# EAGLE design vca (EAGLE 7.2.0)
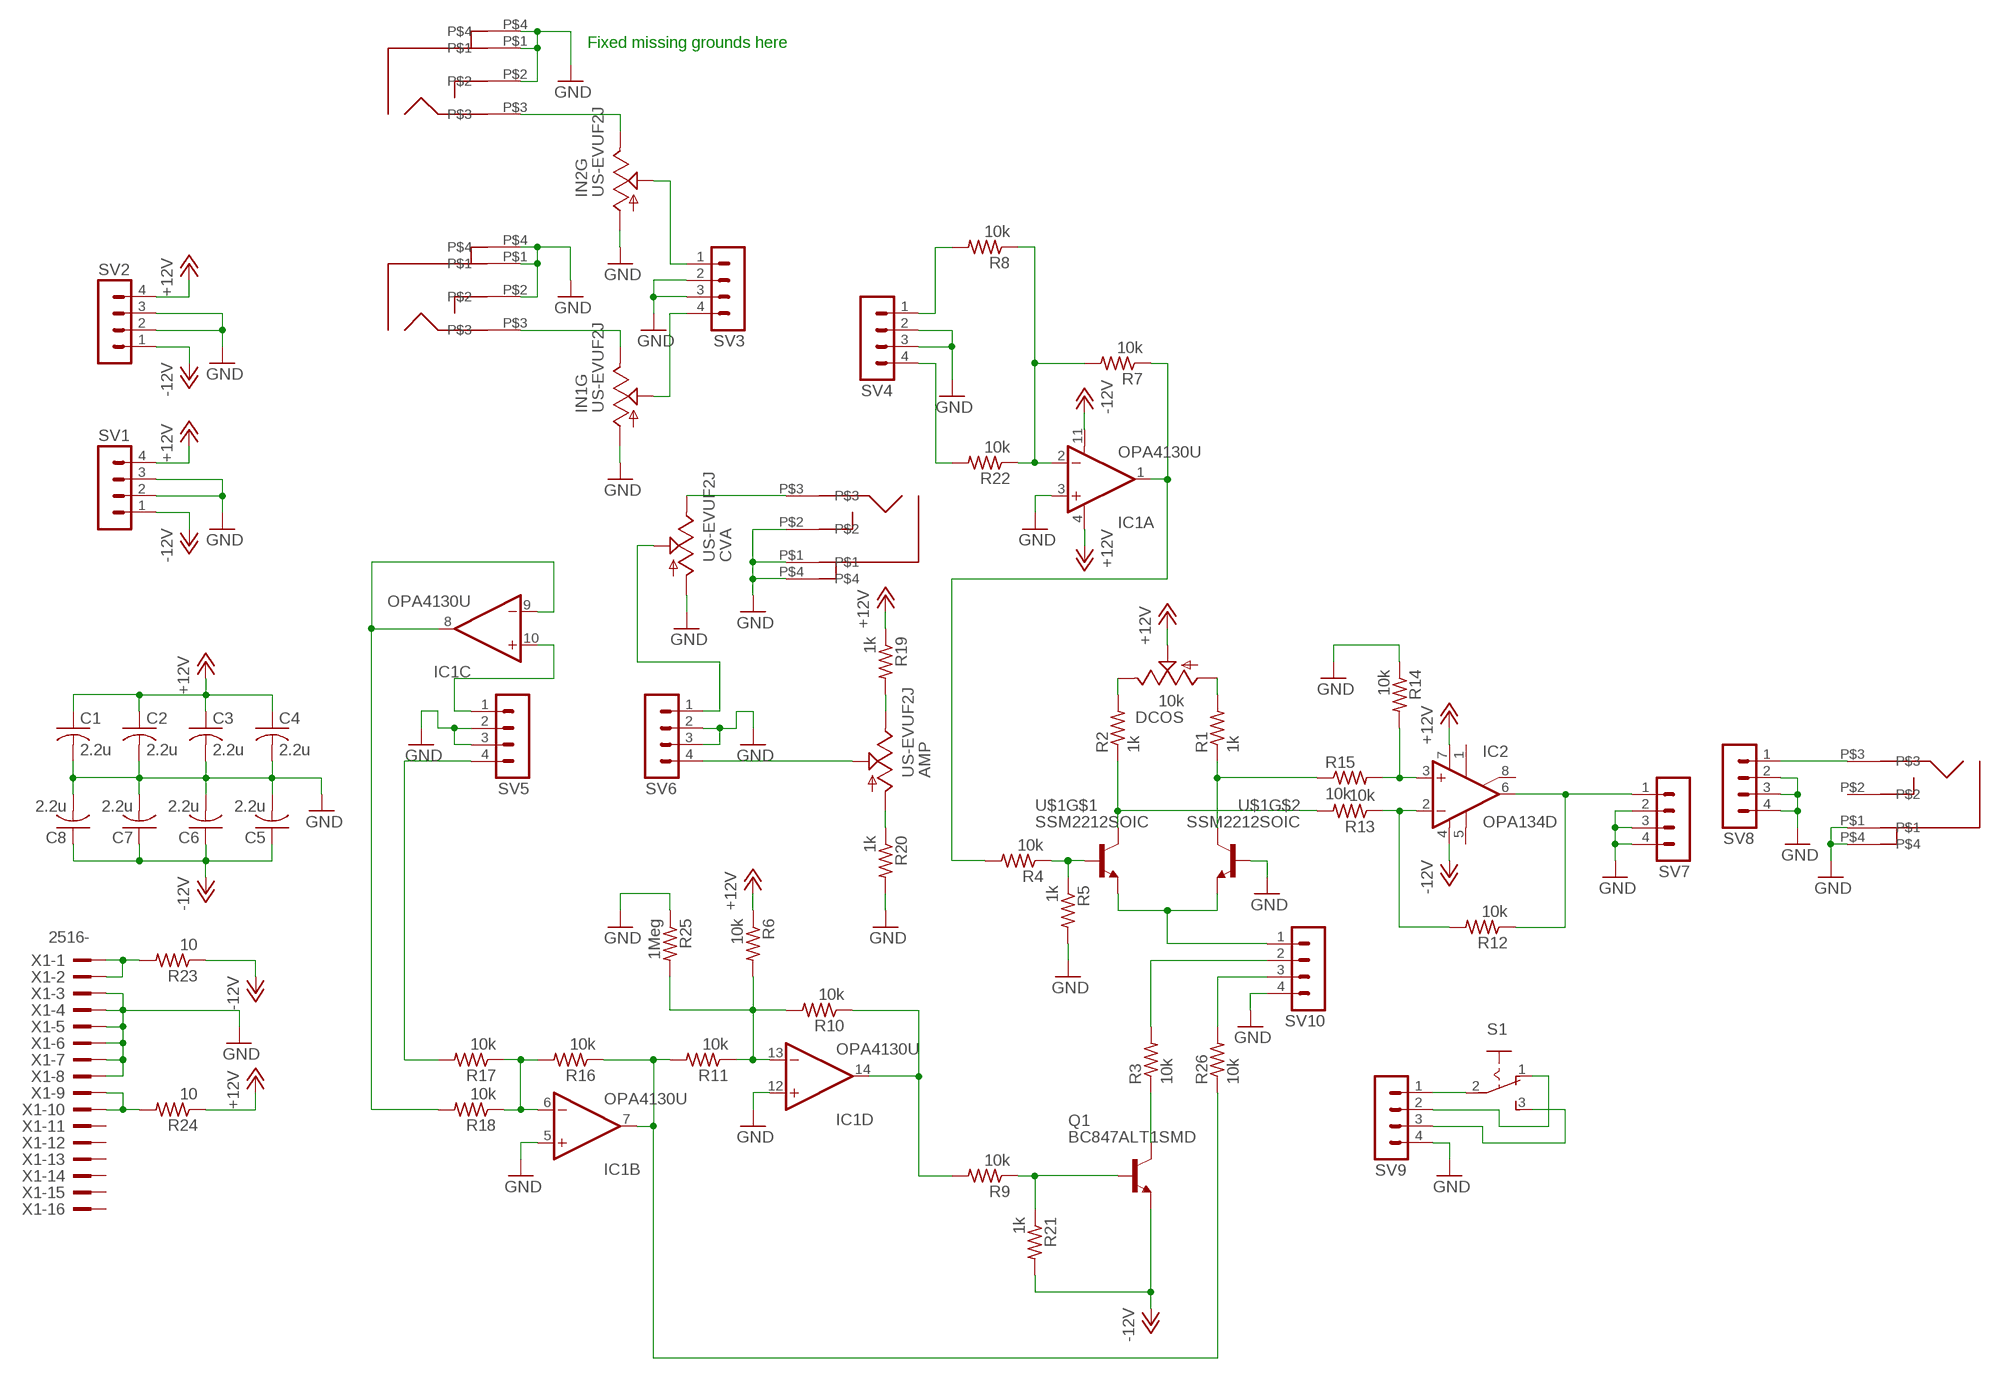
[diagram p0: schematic, sheet 1]

## Parts
AMP  US-EVUF2J  [EVUFXJ]
C1  2.2u  C-USC0603  [C0603]
C2  2.2u  C-USC0603  [C0603]
C3  2.2u  C-USC0603  [C0603]
C4  2.2u  C-USC0603  [C0603]
C5  2.2u  C-USC0603  [C0603]
C6  2.2u  C-USC0603  [C0603]
C7  2.2u  C-USC0603  [C0603]
C8  2.2u  C-USC0603  [C0603]
CVA  US-EVUF2J  [EVUFXJ]
CVIN  PJ301BM  [PJ301BM]
DCOS  10k  TRIM_US-RJ9W  [RJ9W]
IC1  OPA4130U  [SO14]
IC2  OPA134D  [SO08]
IN1  PJ301BM  [PJ301BM]
IN1G  US-EVUF2J  [EVUFXJ]
IN2  PJ301BM  [PJ301BM]
IN2G  US-EVUF2J  [EVUFXJ]
OUT  PJ301BM  [PJ301BM]
Q1  BC847ALT1SMD  [SOT23]
R1  1k  R-US_R0603  [R0603]
R2  1k  R-US_R0603  [R0603]
R3  10k  R-US_R0603  [R0603]
R4  10k  R-US_R0603  [R0603]
R5  1k  R-US_R0603  [R0603]
R6  10k  R-US_R0603  [R0603]
R7  10k  R-US_R0603  [R0603]
R8  10k  R-US_R0603  [R0603]
R9  10k  R-US_R0603  [R0603]
R10  10k  R-US_R0603  [R0603]
R11  10k  R-US_R0603  [R0603]
R12  10k  R-US_R0603  [R0603]
R13  10k  R-US_R0603  [R0603]
R14  10k  R-US_R0603  [R0603]
R15  10k  R-US_R0603  [R0603]
R16  10k  R-US_R0603  [R0603]
R17  10k  R-US_R0603  [R0603]
R18  10k  R-US_R0603  [R0603]
R19  1k  R-US_R0603  [R0603]
R20  1k  R-US_R0603  [R0603]
R21  1k  R-US_R0603  [R0603]
R22  10k  R-US_R0603  [R0603]
R23  10  R-US_R0603  [R0603]
R24  10  R-US_R0603  [R0603]
R25  1Meg  R-US_R0603  [R0603]
R26  10k  R-US_R0603  [R0603]
S1  255SB  [255SB]
SV1  MA04-1  [MA04-1]
SV2  MA04-1  [MA04-1]
SV3  MA04-1  [MA04-1]
SV4  MA04-1  [MA04-1]
SV5  MA04-1  [MA04-1]
SV6  MA04-1  [MA04-1]
SV7  MA04-1  [MA04-1]
SV8  MA04-1  [MA04-1]
SV9  MA04-1  [MA04-1]
SV10  MA04-1  [MA04-1]
U$1  SSM2212SOIC  [SO08]
X1  2516-  [PAK100/2500-16]

## Nets
+12V: C1.1 C2.1 C3.1 C4.1 DCOS.S IC1.4(A:V+) IC2.7(V+) R6.1 R19.1 R24.1 SV1.4 SV2.4
-12V: C5.1 C6.1 C7.1 C8.1 IC1.11(A:V-) IC2.4(V-) Q1.2(E) R21.2 R23.1 SV1.1 SV2.1
GND: C1.2 C2.2 C3.2 C4.2 C5.2 C6.2 C7.2 C8.2 CVA.1(A) CVIN.P$1 CVIN.P$2 CVIN.P$4 IC1.3(A:+IN) IC1.5(B:+IN) IC1.12(D:+IN) IN1.P$1 IN1.P$2 IN1.P$4 IN1G.1(A) IN2.P$1 IN2.P$2 IN2.P$4 IN2G.1(A) OUT.P$1 OUT.P$4 R5.2 R14.1 R20.2 R25.1 SV1.2 SV1.3 SV2.2 SV2.3 SV3.2 SV3.3 SV4.2 SV4.3 SV5.2 SV5.3 SV6.2 SV6.3 SV7.2 SV7.3 SV7.4 SV8.2 SV8.3 SV8.4 SV9.4 SV10.4 U$1.7(B) X1.3 X1.4 X1.5 X1.6 X1.7 X1.8
N$1: SV10.1 U$1.3(E) U$1.6(E)
N$2: R4.1 R5.1 U$1.2(B)
N$3: R2.1 R13.2 U$1.1(C)
N$4: R1.1 R15.1 U$1.8(C)
N$5: OUT.P$3 SV8.1
N$6: IC1.8(C:OUT) IC1.9(C:-IN) R18.2
N$7: Q1.3(C) R3.1
N$8: Q1.1(B) R9.1 R21.1
N$9: IC1.14(D:OUT) R9.2 R10.1
N$10: IC1.2(A:-IN) R7.2 R8.1 R22.1
N$11: IC1.1(A:OUT) R4.2 R7.1
N$12: IC1.13(D:-IN) R6.2 R10.2 R11.1 R25.2
N$13: IC2.3(+IN) R14.2 R15.2
N$14: DCOS.E R2.2
N$15: DCOS.A R1.2
N$16: IC2.2(-IN) R12.2 R13.1
N$18: IC2.6(OUT) R12.1 SV7.1
N$19: IN2G.2(S) SV3.1
N$20: IC1.6(B:-IN) R16.2 R17.1 R18.1
N$21: IN1G.2(S) SV3.4
N$22: AMP.3(E) R19.2
N$23: AMP.1(A) R20.1
N$24: R17.2 SV5.4
N$25: IN1.P$3 IN1G.3(E)
N$26: CVA.3(E) CVIN.P$3
N$27: IN2.P$3 IN2G.3(E)
N$28: R8.2 SV4.1
N$29: R22.2 SV4.4
N$30: R23.2 X1.1 X1.2
N$31: CVA.2(S) SV6.1
N$32: AMP.2(S) SV6.4
N$33: IC1.10(C:+IN) SV5.1
N$34: R24.2 X1.9 X1.10
N$35: R3.2 SV10.2
N$36: IC1.7(B:OUT) R11.2 R16.1 R26.1
N$37: S1.2(P) SV9.1
N$38: R26.2 SV10.3
N$40: S1.1(O) SV9.2
N$41: S1.3(S) SV9.3
Unconnected: IC2.1(ON1) IC2.5(OPT) IC2.8(ON2) OUT.P$2 X1.11 X1.12 X1.13 X1.14 X1.15 X1.16

## Notes on the sheet
- Fixed missing grounds here

## Library data of the parts
AMP CVA IN1G IN2G = dan:US-EVU: 9 mm Square Rotary Potentiometers Source: Panasonic
C1-C8 = dan:C-US: CAPACITOR, American symbol
CVIN IN1 IN2 OUT = dan:PJ301BM
DCOS = dan:TRIM_US-: POTENTIOMETER
IC1 = dan:OPA4130: Low Power, Precision FET-Input Operational Amplifiers; MF: TEXAS INSTRUMENTS; MPN: OPA4130UA; OC_FARNELL: 1648707; OC_NEWARK: 80K8080
IC2 = dan:OPA134: AUDIO AMPLIFIER
Q1 = dan:BC847*: NPN Transistor
R1-R26 = dan:R-US_: RESISTOR, American symbol
S1 = dan:255SB: SLIDING SWITCH Distributor Buerklin, 11G810
SV1-SV10 = dan:MA04-1: PIN HEADER; OC_FARNELL: unknown; OC_NEWARK: unknown
U$1 = dan:SSM2212
X1 = dan:2516-: 3M (TM) Pak 100 4-Wall Header Source: 3M; OC_FARNELL: unknown; OC_NEWARK: unknown

## Board
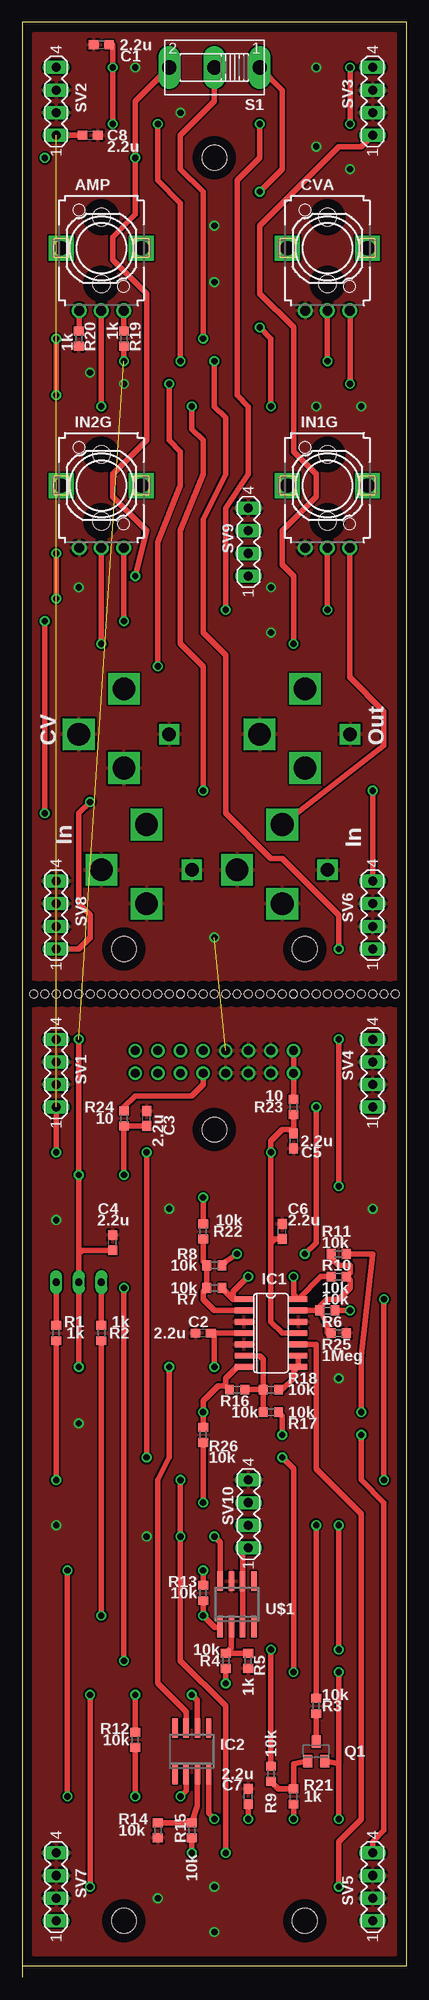
[diagram p1: board, top side]
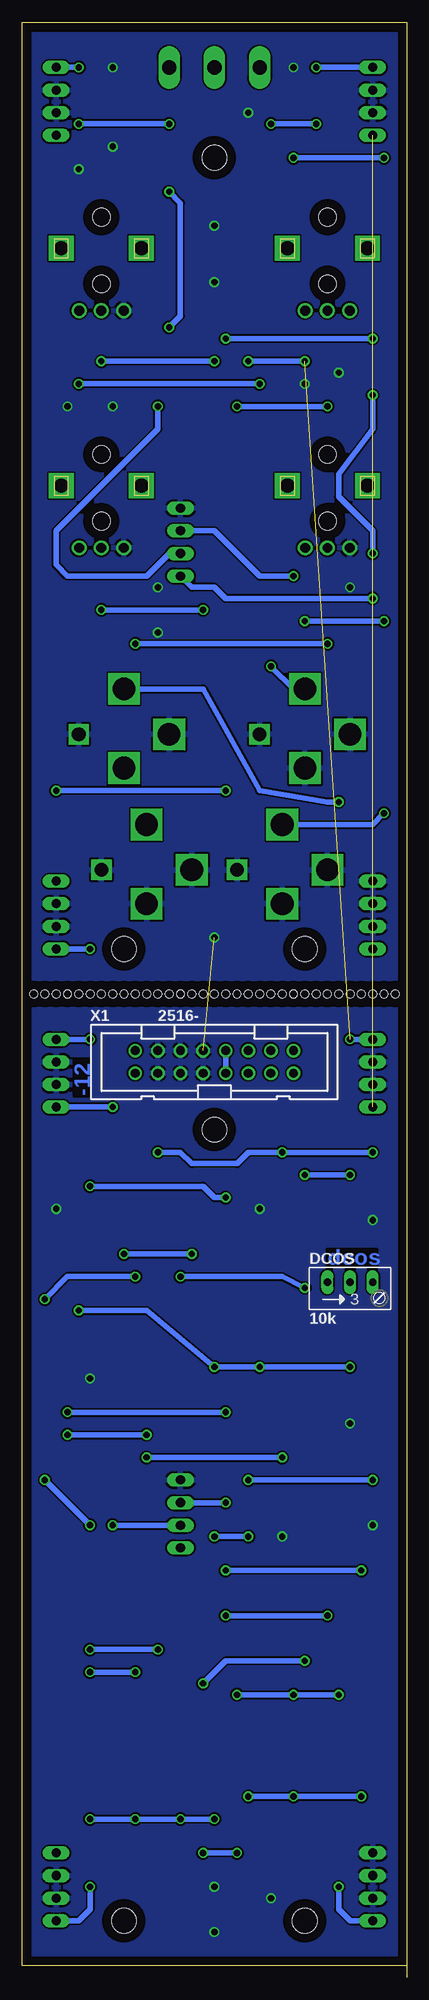
[diagram p2: board, bottom side, seen from below]

Size 43.18 x 219.71 mm. Coordinates in mm from the lower left corner, seen from the top.
Outline: 0,1.27 43.18,1.27 43.18,219.71 0,219.71 0,1.27
Outline: 0,1.27 0,0
Copper layers (1*16): Top 0.035mm / dielectric 1.5mm / Bottom 0.035mm
Design rules "default": minimum track width 10mil, minimum drill 24mil, track to track 8mil, track to pad 8mil, pad to pad 8mil, via to via 8mil, smd to smd 8mil, copper to edge 40mil, drill to drill 8mil, minimum pad ring 10mil, minimum via ring 8mil, stop-mask expansion 4mil, vias tented up to drill 0mil, thermal gap 10mil
Holes 0.9 mm at 1.27,110.49 2.54,110.49 3.81,110.49 5.08,110.49 6.35,110.49 7.62,110.49 8.89,110.49 10.16,110.49 11.43,110.49 12.7,110.49 13.97,110.49 15.24,110.49 16.51,110.49 17.78,110.49 19.05,110.49 20.32,110.49 21.59,110.49 22.86,110.49 24.13,110.49 25.4,110.49 26.67,110.49 27.94,110.49 29.21,110.49 30.48,110.49 31.75,110.49 33.02,110.49 34.29,110.49 35.56,110.49 36.83,110.49 38.1,110.49 39.37,110.49 40.64,110.49 41.91,110.49
Holes 2.8 mm at 11.43,6.35 31.75,6.35 31.75,115.57 11.43,115.57 21.59,95.25 21.59,204.47

### Footprints (pad centres in the part's own frame; a part is rotated, then mirrored left to right if it is on the bottom)
EVUFXJ = drill 1.1 pad 1.676: 1 -2.5,-7; 2 0,-7; 3 2.5,-7 | drill 1.6 pad 2.8 square: M1 4.5,0; M2 -4.5,0 | hole 2: 0,3.5; 0,-4
C0603 = smd 1.1 x 1: 1 -0.85,0; 2 0.85,0
PJ301BM = drill 1.524 square: P$1 5.08,0 | drill 2.54 square: P$2 0,-3.81; P$3 0,5.08; P$4 -5.08,0
RJ9W = drill 0.813 long: A 2.54,0.635; E -2.54,0.635; S 0,0.635
SO14 = smd 0.66 x 2.032: 1 -3.81,-3.073; 2 -2.54,-3.073; 3 -1.27,-3.073; 4 0,-3.073; 5 1.27,-3.073; 6 2.54,-3.073; 7 3.81,-3.073; 8 3.81,3.073; 9 2.54,3.073; 10 1.27,3.073; 11 0,3.073; 12 -1.27,3.073; 13 -2.54,3.073; 14 -3.81,3.073
SO08 = smd 0.6 x 2.2: 1 -1.905,-2.6; 2 -0.635,-2.6; 3 0.635,-2.6; 4 1.905,-2.6; 5 1.905,2.6; 6 0.635,2.6; 7 -0.635,2.6; 8 -1.905,2.6
SOT23 = smd 1 x 1.4: 1 -0.95,-1.1; 2 0.95,-1.1; 3 0,1.1
R0603 = smd 1 x 1.1: 1 -0.85,0; 2 0.85,0
255SB = drill 1.6 long: 1 -5.08,0; 2 0,0; 3 5.08,0
MA04-1 = drill 1.016 long: 1 -3.81,0; 2 -1.27,0; 3 1.27,0; 4 3.81,0
PAK100/2500-16 = drill 1 pad 1.422: 1 -8.89,-1.27; 2 -8.89,1.27; 3 -6.35,-1.27; 4 -6.35,1.27; 5 -3.81,-1.27; 6 -3.81,1.27; 7 -1.27,-1.27; 8 -1.27,1.27; 9 1.27,-1.27; 10 1.27,1.27; 11 3.81,-1.27; 12 3.81,1.27; 13 6.35,-1.27; 14 6.35,1.27; 15 8.89,-1.27; 16 8.89,1.27

### Placement (x,y rotation side)
AMP  8.89,194.31 0 top
C1  8.89,217.17 180 top
C2  20.32,72.39 180 top
C3  13.97,96.52 90 top
C4  10.16,82.55 90 top
C5  30.48,93.98 270 top
C6  29.21,83.82 90 top
C7  25.4,20.32 90 top
C8  7.62,207.01 0 top
CVA  34.29,194.31 0 top
CVIN  11.43,139.7 0 top
DCOS  6.35,77.47 0 bottom
IC1  27.94,72.39 270 top
IC2  19.05,25.4 0 top
IN1  29.21,124.46 0 top
IN1G  34.29,167.64 0 top
IN2  13.97,124.46 0 top
IN2G  8.89,167.64 0 top
OUT  31.75,139.7 0 top
Q1  33.02,25.4 0 top
R1  3.81,72.39 90 top
R2  8.89,72.39 90 top
R3  33.02,30.48 90 top
R4  22.86,35.56 270 top
R5  25.4,35.56 270 top
R6  34.29,74.93 180 top
R7  21.59,77.47 180 top
R8  21.59,80.01 0 top
R9  27.94,22.86 90 top
R10  35.56,78.74 0 top
R11  35.56,81.28 0 top
R12  12.7,26.67 270 top
R13  20.32,43.18 270 top
R14  15.24,16.51 90 top
R15  19.05,16.51 90 top
R16  24.13,66.04 0 top
R17  27.94,63.5 0 top
R18  27.94,66.04 0 top
R19  11.43,184.15 90 top
R20  6.35,184.15 270 top
R21  30.48,20.32 270 top
R22  20.32,83.82 90 top
R23  30.48,97.79 90 top
R24  11.43,96.52 90 top
R25  35.56,72.39 180 top
R26  20.32,60.96 270 top
S1  21.59,214.63 180 top
SV1  3.81,101.6 90 top
SV2  3.81,210.82 90 top
SV3  39.37,210.82 90 top
SV4  39.37,101.6 90 top
SV5  39.37,10.16 90 top
SV6  39.37,119.38 90 top
SV7  3.81,10.16 90 top
SV8  3.81,119.38 90 top
SV9  25.4,161.29 90 top
SV10  25.4,52.07 90 top
U$1  24.13,41.91 0 top
X1  21.59,102.87 0 bottom

### Tracks (layer width: path | path; a pad name or v marks a point on that pad's centre or on a via)
+12V  (via drill 0.7)  (1 unrouted)
  Top 0.61: IC1.4 C2.1 21.59,71.97 v21.59,68.58 | v6.35,68.58 DCOS.S 6.35,81.28 | v11.43,90.17 R24.1 C3.1 | 6.35,81.28 v6.35,90.17 v6.35,105.41 | C4.1 6.77,81.7 6.35,81.28 | IC2.7 18.41,29.84 15.24,33.02 15.24,55.88 16.51,58.42 v16.51,68.58 | R6.1 v36.83,74.93 | R19.1 v11.43,181.61 | C1.1 10.16,217.17 v10.16,214.63 v10.16,208.28 | v17.78,181.61 17.78,199.39 15.24,201.93 v15.24,208.28
  Bottom 0.61: v6.35,68.58 v16.51,68.58 v21.59,68.58 29.21,74.93 v36.83,74.93 | v11.43,90.17 v6.35,90.17 | v6.35,105.41 SV1.4 | SV2.4 v10.16,214.63 | v11.43,181.61 v17.78,181.61 | v15.24,208.28 v10.16,208.28
-12V  (via drill 0.7)  (1 unrouted)
  Top 0.61: R21.2 v30.48,17.78 | v35.56,17.78 35.56,23.98 | 35.56,23.98 Q1.2 | IC1.11 29.21,72.39 27.94,73.66 27.94,82.55 | 27.94,82.55 v27.94,92.71 27.94,93.98 29.21,95.25 30.06,95.25 C5.1 R23.1 | v3.81,92.71 SV1.1 | IC2.4 20.95,18.41 v21.59,17.78 | v13.97,58.42 v13.97,92.71 | v30.48,34.29 30.48,57.15 v29.21,58.42 | C7.1 v25.4,17.78 | v35.56,34.29 35.56,23.98 | C8.1 SV2.1 | C6.1 28.36,82.97 27.94,82.55
  Bottom 0.61: v35.56,17.78 v30.48,17.78 v25.4,17.78 v21.59,17.78 | v3.81,92.71 v13.97,92.71 17.78,92.71 19.05,91.44 24.13,91.44 25.4,92.71 v27.94,92.71 | v29.21,58.42 v13.97,58.42 | v30.48,34.29 v35.56,34.29
GND  (via drill 0.7)  (1 unrouted)
  other vias: 13.97,49.53 3.81,50.8 6.35,62.23 35.56,67.31 39.37,86.36 16.51,86.36 3.81,85.09 21.59,5.08 21.59,10.16 21.59,116.84 21.59,190.5 36.83,203.2 38.1,176.53 7.62,180.34 33.02,205.74 33.02,214.63 12.7,214.63 17.78,209.55 21.59,196.85 27.94,156.21 6.35,156.21 33.02,176.53 11.43,179.07 27.94,151.13 15.24,8.89
  pour Top: 1.27,109.22 41.91,109.22 41.91,2.54 1.27,2.54
  pour Top: 1.27,218.44 41.91,218.44 41.91,111.76 1.27,111.76
  pour Bottom: 1.27,109.22 41.91,109.22 41.91,2.54 1.27,2.54
  pour Bottom: 1.27,218.44 41.91,218.44 41.91,111.76 1.27,111.76
N$1
  Top 0.61: U$1.3 U$1.6 24.77,47.62 SV10.1
N$2
  Top 0.61: R5.1 R4.1 23.5,37.05 U$1.2
N$3  (via drill 0.7)
  Top 0.61: R2.1 v8.89,40.64 | R13.2 v20.32,40.64 21.65,39.31 U$1.1
  Bottom 0.61: v8.89,40.64 v20.32,40.64
N$4  (via drill 0.7)
  Top 0.61: U$1.8 22.23,48.9 v21.59,49.53 | v3.81,55.88 R1.1 | R15.1 v19.05,13.97 | v22.86,13.97 22.86,30.48 17.78,35.56 v17.78,49.53 v17.78,55.88
  Bottom 0.61: v17.78,55.88 v3.81,55.88 | v19.05,13.97 v22.86,13.97 | v21.59,49.53 v17.78,49.53
N$5  (via drill 0.7)
  Top 0.61: SV8.1 6.35,115.57 7.62,116.84 7.62,119.38 6.35,120.65 6.35,130.81 v7.62,132.08
  Bottom 0.61: OUT.P$3 22.86,144.78 16.51,133.35 8.89,132.08 v7.62,132.08
N$6
  Top 0.61: R18.2 29.21,66.04 30.48,67.31 30.48,68.05 IC1.8 IC1.9
N$7
  Top 0.61: Q1.3 R3.1
N$8
  Top 0.61: Q1.1 30.48,23.98 R21.1 28.78,21.17 R9.1
N$9  (via drill 0.7)
  Top 0.61: R10.1 33.55,78.74 IC1.14 30.48,76.73 v30.48,78.74 | v35.56,36.83 v35.56,50.8 | v40.64,55.88 v40.64,76.2 | R9.2 v27.94,36.83
  Bottom 0.61: v27.94,36.83 v35.56,36.83 | v35.56,50.8 v40.64,55.88 | v30.48,78.74 38.1,78.74 v40.64,76.2
N$10
  Top 0.61: IC1.2 21.59,74.93 20.32,76.2 20.32,77.05 R7.2 R8.1 20.32,80.43 R22.1
N$11  (via drill 0.7)
  Top 0.61: IC1.1 23.71,76.2 | 23.71,76.2 R7.1 | 23.71,76.2 23.71,77.05 v25.4,78.74 | v11.43,77.47 v11.43,35.56 | v22.86,33.02 R4.2
  Bottom 0.61: v25.4,78.74 13.97,78.74 v11.43,77.47 | v11.43,35.56 20.32,35.56 v22.86,33.02
N$12
  Top 0.61: R6.2 IC1.13 | R11.1 34.71,80.86 35.56,80.01 36.83,80.01 36.83,79.16 R10.2 36.83,78.32 36.83,77.47 35.56,76.2 34.29,76.2 33.44,75.35 R6.2 | R25.2 34.29,72.39 34.29,73.24 R6.2
N$13
  Top 0.61: R14.2 R15.2 19.68,19.27 IC2.3
N$14
  Top 0.61: R2.2 DCOS.E
N$15
  Top 0.61: DCOS.A R1.2
N$16  (via drill 0.7)
  Top 0.61: IC2.2 18.41,20.95 v17.78,20.32 | R12.2 v12.7,20.32 | v5.08,20.32 v5.08,45.72 | R13.1 v20.32,45.72
  Bottom 0.61: v17.78,20.32 v12.7,20.32 v5.08,20.32 | v5.08,45.72 v20.32,45.72
N$18  (via drill 0.7)
  Top 0.61: R12.1 v12.7,31.75 | IC2.6 19.68,31.11 v19.05,31.75 | v7.62,10.16 v7.62,31.75
  Bottom 0.61: v19.05,31.75 v12.7,31.75 v7.62,31.75 | v7.62,10.16 7.62,7.62 6.35,6.35 SV7.1
N$19  (via drill 0.7)
  Top 0.61: v8.89,149.86 IN2G.2 | v30.48,149.86 30.48,157.48 29.21,158.75 29.21,162.56 33.02,166.37 33.02,168.91 30.48,171.45 30.48,185.42 26.67,189.23 26.67,196.85 35.56,205.74 38.1,205.74 SV3.1
  Bottom 0.61: v30.48,149.86 v8.89,149.86
N$20
  Top 0.61: R18.1 27.09,69.43 26.67,69.85 IC1.6 | R17.1 R18.1 | R16.2 R18.1
N$21  (via drill 0.7)
  Top 0.61: v34.29,153.67 IN1G.2 | v36.83,208.28 v36.83,214.63 | v22.86,153.67 22.86,165.1 25.4,168.91 25.4,176.53 24.13,177.8 24.13,201.93 26.67,204.47 v26.67,208.28
  Bottom 0.61: v22.86,153.67 v34.29,153.67 | v26.67,208.28 v36.83,208.28 | v36.83,214.63 SV3.4
N$22
  Top 0.61: R19.2 11.39,185 AMP.3
N$23
  Top 0.61: R20.1 6.39,185 AMP.1
N$24  (via drill 0.7)
  Top 0.61: v29.21,60.96 29.21,63.08 R17.2 | v38.1,60.96 38.1,55.88 40.64,53.34 40.64,16.51 39.37,15.24 SV5.4
  Bottom 0.61: v38.1,60.96 v29.21,60.96
N$25
  Top 0.61: IN1G.3 36.79,146.09 40.64,142.24 40.64,138.43 IN1.P$3
N$26  (via drill 0.7)
  Top 0.61: v36.83,179.07 36.83,187.27 CVA.3 | v15.24,147.32 15.24,161.29 17.78,167.64 17.78,171.45 16.51,172.72 v16.51,179.07
  Bottom 0.61: v16.51,179.07 v36.83,179.07 | CVIN.P$3 12.7,144.78 v15.24,147.32
N$27  (via drill 0.7)
  Top 0.61: IN2G.3 11.39,152.44 v11.43,152.4 | v2.54,152.4 v2.54,130.81
  Bottom 0.61: v11.43,152.4 v2.54,152.4 | IN2.P$3 3.81,129.54 v2.54,130.81
N$28  (via drill 0.7)
  Top 0.61: v31.75,81.28 33.02,82.55 v33.02,97.79 | v24.13,81.28 22.86,80.43 R8.2
  Bottom 0.61: v31.75,81.28 v24.13,81.28 | v33.02,97.79 SV4.1
N$29  (via drill 0.7)
  Top 0.61: v20.32,87.63 R22.2 | v35.56,105.41 v35.56,88.9
  Bottom 0.61: v20.32,87.63 21.59,87.63 22.86,88.9 v35.56,88.9 | SV4.4 v35.56,105.41
N$30
  Top 0.61: X1.2 X1.1 R23.2
N$31  (via drill 0.7)
  Top 0.61: v34.29,181.61 CVA.2 | v21.59,181.61 21.59,176.53 22.86,175.26 22.86,168.91 20.32,163.83 20.32,151.13 22.86,148.59 22.86,130.81 27.94,125.73 29.21,125.73 35.56,119.38 v35.56,115.57
  Bottom 0.61: v21.59,181.61 v34.29,181.61 | v35.56,115.57 SV6.1
N$32  (via drill 0.7)
  Top 0.61: v8.89,176.53 AMP.2 | v39.37,133.35 SV6.4 | v20.32,133.35 20.32,147.32 17.78,149.86 17.78,162.56 20.32,168.91 20.32,172.72 19.05,173.99 v19.05,176.53
  Bottom 0.61: v20.32,133.35 v39.37,133.35 | v8.89,176.53 v19.05,176.53
N$33  (via drill 0.7)
  Top 0.61: IC1.10 33.02,71.12 33.02,57.15 38.1,52.07 38.1,17.78 35.56,15.24 v35.56,10.16
  Bottom 0.61: v35.56,10.16 35.56,7.62 36.83,6.35 SV5.1
N$34
  Top 0.61: R24.2 11.43,97.79 12.7,99.06 19.05,99.06 20.32,100.33 X1.9
  Bottom 0.61: X1.10 X1.9
N$35  (via drill 0.7)
  Top 0.61: R3.2 v33.02,50.8
  Bottom 0.61: v33.02,50.8 SV10.2
N$36  (via drill 0.7)
  Top 0.61: IC1.7 24.13,68.58 22.86,67.31 22.86,66.46 | 22.86,66.46 R16.1 | R11.2 39.37,81.28 38.1,69.85 v38.1,63.5 | 22.86,66.46 22.01,66.46 20.32,64.77 v20.32,63.5 R26.1
  Bottom 0.61: v38.1,63.5 v20.32,63.5
N$37  (via drill 0.7)
  Top 0.61: v3.81,184.15 v3.81,177.8 | v3.81,160.02 v3.81,154.94 | v20.32,184.15 20.32,200.66 17.78,203.2 17.78,207.01 21.59,210.82 S1.2
  Bottom 0.61: v3.81,184.15 v20.32,184.15 | v3.81,177.8 3.81,173.99 7.62,168.91 7.62,166.37 3.81,162.56 v3.81,160.02 | v3.81,154.94 20.32,154.94 21.59,156.21 24.13,156.21 SV9.1
N$38  (via drill 0.7)
  Top 0.61: R26.2 v20.32,53.34
  Bottom 0.61: v20.32,53.34 SV10.3
N$40  (via drill 0.7)
  Top 0.61: v27.94,176.53 27.94,184.15 v26.67,185.42 | v26.67,200.66 29.21,203.2 29.21,212.09 S1.1
  Bottom 0.61: v27.94,176.53 27.94,173.99 39.37,162.56 39.37,158.75 38.1,157.48 29.21,157.48 26.67,160.02 SV9.2 | v26.67,185.42 25.4,186.69 25.4,199.39 v26.67,200.66
N$41  (via drill 0.7)
  Top 0.61: S1.3 12.7,210.82 v12.7,204.47 12.7,198.12 10.16,195.58 10.16,193.04 13.97,189.23 13.97,172.72 10.16,168.91 10.16,166.37 13.97,162.56 v12.7,157.48
  Bottom 0.61: SV9.3 21.59,162.56 16.51,157.48 v12.7,157.48 | v12.7,204.47 v2.54,204.47

### Text on the board
Bottom: -12 | dcos
tPlace: CV | Out | In | In